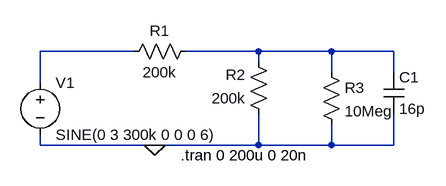
[diagram p0: schematic Exp2part7.asc]
Exp2part7.asc, the LTspice schematic file:
Version 4
SHEET 1 880 680
WIRE 96 96 -48 96
WIRE 288 96 176 96
WIRE 400 96 288 96
WIRE 496 96 400 96
WIRE 288 112 288 96
WIRE 400 128 400 96
WIRE 496 128 496 96
WIRE -48 144 -48 96
WIRE -48 240 -48 224
WIRE 128 240 -48 240
WIRE 288 240 288 192
WIRE 288 240 128 240
WIRE 400 240 400 208
WIRE 400 240 288 240
WIRE 496 240 496 192
WIRE 496 240 400 240
FLAG 128 240 0
SYMBOL voltage -48 128 R0
WINDOW 123 0 0 Left 0
WINDOW 39 0 0 Left 0
SYMATTR InstName V1
SYMATTR Value SINE(0 3 300k 0 0 0 6)
SYMBOL res 192 80 R90
WINDOW 0 0 56 VBottom 2
WINDOW 3 32 56 VTop 2
SYMATTR InstName R1
SYMATTR Value 200k
SYMBOL res 304 208 R180
WINDOW 0 36 76 Left 2
WINDOW 3 36 40 Left 2
SYMATTR InstName R2
SYMATTR Value 200k
SYMBOL res 384 112 R0
SYMATTR InstName R3
SYMATTR Value 10Meg
SYMBOL cap 480 128 R0
SYMATTR InstName C1
SYMATTR Value 16p
TEXT 168 256 Left 2 !.tran 0 200u 0 20n

The netlist it stands for:
* Exp2part7.asc
V1 N001 0 SINE(0 3 300k 0 0 0 6)
R1 N002 N001 200k
R2 0 N002 200k
R3 N002 0 10Meg
C1 N002 0 16p
.tran 0 200u 0 20n
.backanno
.end